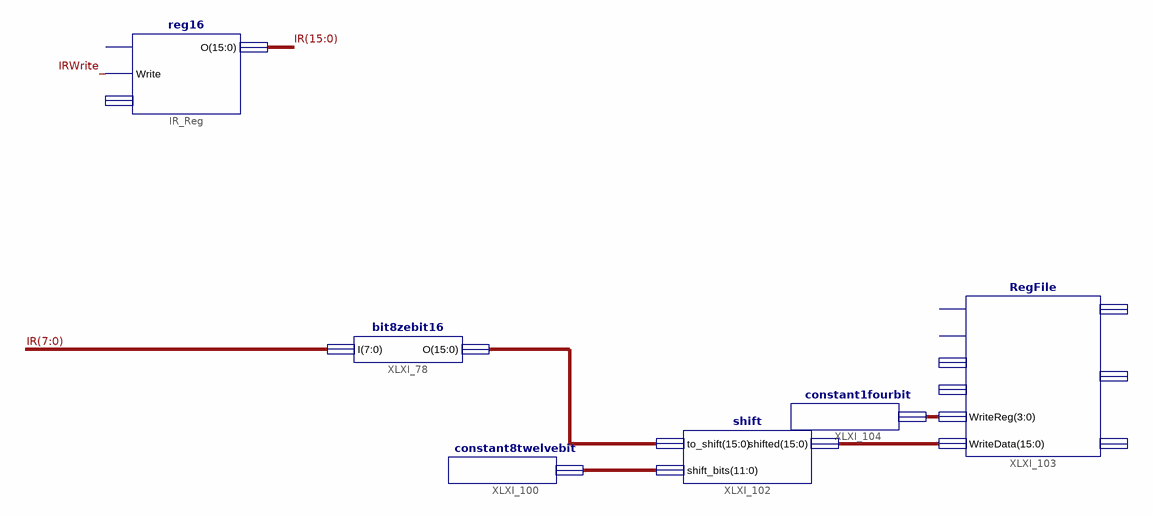
[diagram p0: schematic sheet 1]
// Xilinx ISE schematic lui.sch (spartan3adsp) as structural Verilog: 6 symbols, 0 ports
module lui (
);

  wire IRWrite;
  wire [3:0] XLXN_279;
  wire [11:0] XLXN_256;
  wire [15:0] IR, XLXN_274, XLXN_278;

  reg16 IR_Reg (.Write(IRWrite), .O(IR));  // open: CLK, I
  bit8zebit16 XLXI_78 (.I(IR[7:0]), .O(XLXN_274));
  constant8twelvebit XLXI_100 (.O(XLXN_256));
  shift XLXI_102 (.to_shift(XLXN_274), .shift_bits(XLXN_256), .shifted(XLXN_278));
  RegFile XLXI_103 (
    .WriteReg(XLXN_279), .WriteData(XLXN_278));  // open: RegWrite, clock, Read1, Read2, Data1, Data2, Data3
  constant1fourbit XLXI_104 (.O(XLXN_279));
endmodule
